# Altium schematic sheet OT252020MJBA4SL.schdoc
size 127 x 101 mm
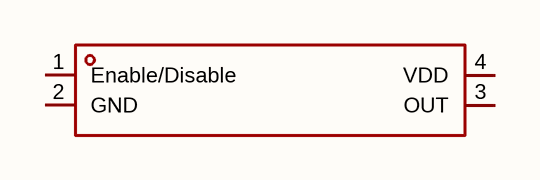
[diagram p0: OT252020MJBA4SL.schdoc]

## Parts
X?  ot252020mjba4sl  [OSC-SMD_4P-L2.5-W2.0-BL]  (value not drawn)

## Nets

Not connected (* = marked no-connect by the designer): X? 1(Enable/Disable) 2(GND) 3(OUT) 4(VDD)

## Library data of the parts
X? = ot252020mjba4sl: 频率:20MHz;常温频差:±10ppm;输出模式:CMOS;工作电压:1.8V~3.3V;工作电流:4mA;频率稳定度:±20ppm;; Manufacturer: YXC(扬兴晶振); AddInBom: yes; ModelId: 6c59bf18646c482ead3932fe5df36485; ModelName: OSC-SMD_4P-L2.5-W2.0-H0.6; ModelTransform: 98.425,78.74,0,0,0,0,0.0005,0,0; Value: 20MHz; Normal temperature Frequency Tolerance: ±10ppm; Output Type: CMOS; Current - Supply: 4mA; Frequency Stability: ±20ppm; Symbol: OT252020MJBA4SL; LCSC Part Name: YSO110TR 20MHZ 1.8V-3.3V ±10PPM -40~85℃（±20PPM) CMOS; SupplierPart: C669067; ManufacturerPart: OT252020MJBA4SL; Supplier Footprint: SMD2520-4P; JLCPCB Part Class: Extended Part; Datasheet: https://item.szlcsc.com/datasheet/OT252020MJBA4SL/699167.html; Supplier: LCSC; ConvertToPcb: yes; FootprintName: OSC-SMD_4P-L2.5-W2.0-BL; Voltage - Supply: 1.8V~3.3V; Operating Temperature: -40℃~+85℃